# Altium schematic sheet Analog Interfaces.SchDoc: Analog Interfaces
size A4; Date: Not used; ApprovedBy: Not used; CheckedBy: Not used; Author: Not used; CompanyName: STMicroelectronics; DrawnBy: Not used; Engineer: Not used; Organization: Not used; Address1: Not used; Address2: Not used; Address3: Not used; Address4: Not used; DocumentNumber: Not used; Revision: Not used; SheetNumber: 13; SheetTotal: 22; CurrentTime: Not used; CurrentDate: Not used; Time: Not used; DocumentFullPathAndName: Not used; DocumentName: Not used; ModifiedDate: Not used; ImagePath: Not used; ProjectName: Not used; Application_BuildNumber: Not used
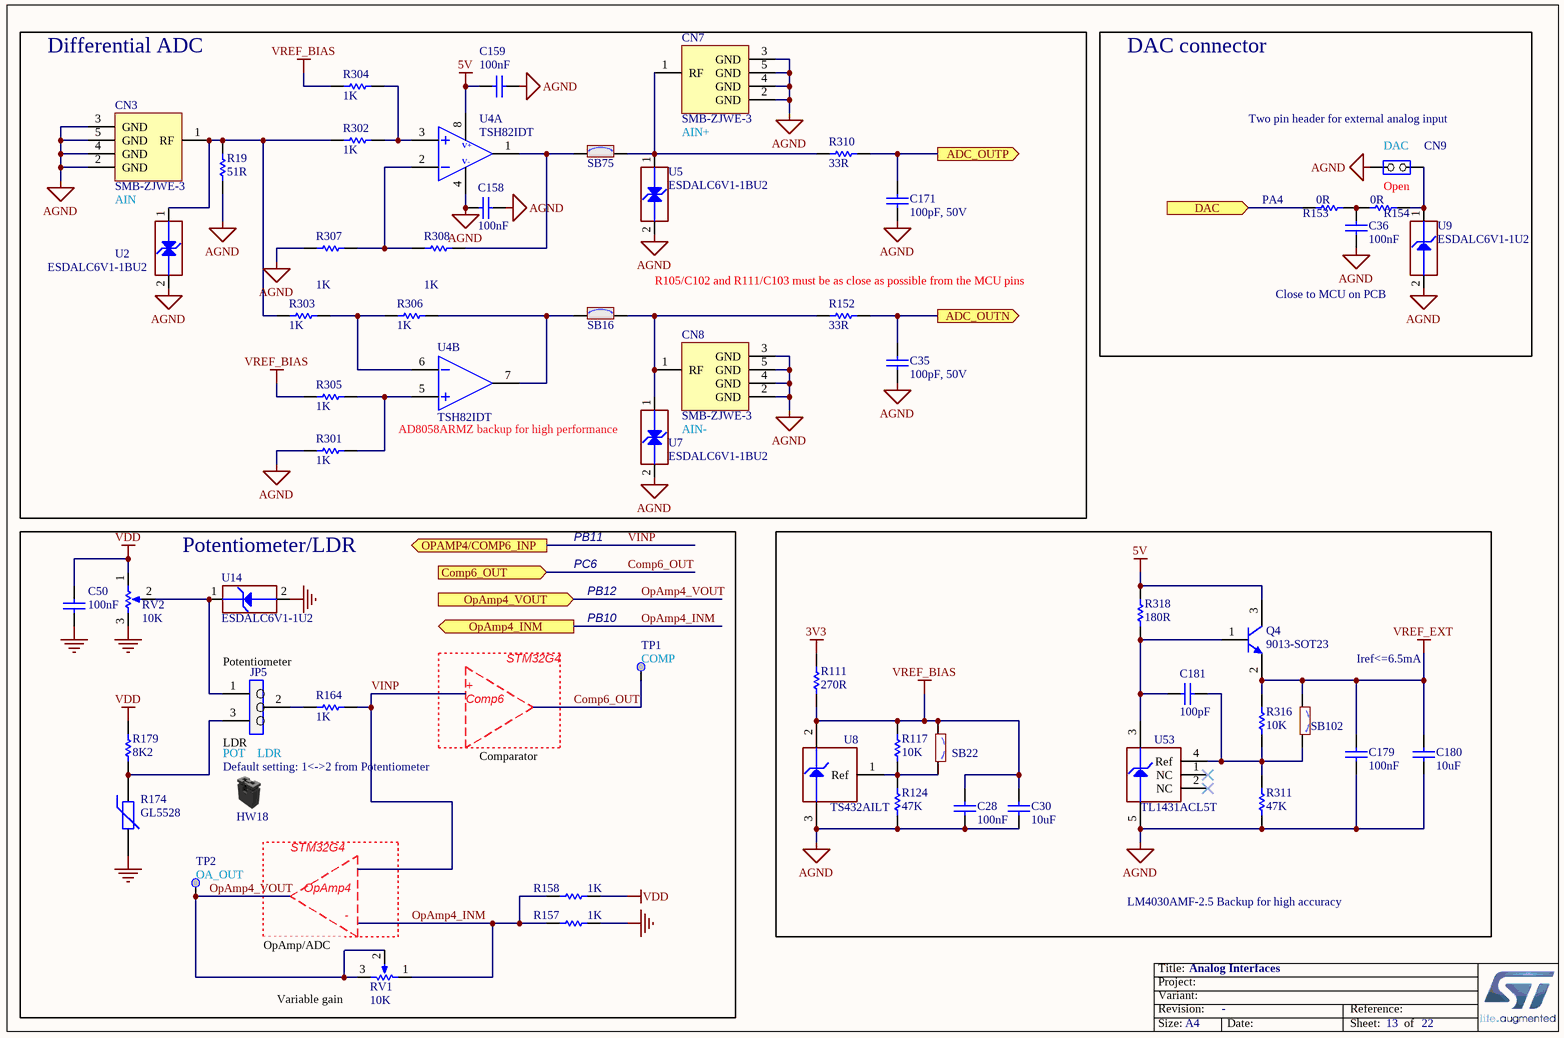
[diagram p0: Analog Interfaces.SchDoc]

## Parts
C28  value 100nF  [C0603]  (hidden comment: Capacitor)
C30  value 10uF  [C0603]  (hidden comment: Capacitor)
C35  value 100pF, 50V  [C0603]  (hidden comment: Capacitor)
C36  value 100nF  [C0603]  (hidden comment: Capacitor)
C50  value 100nF  [C0402]  (hidden comment: Capacitor)
C158  value 100nF  [C0603]  (hidden comment: Capacitor)
C159  value 100nF  [C0603]  (hidden comment: Capacitor)
C171  value 100pF, 50V  [C0603]  (hidden comment: Capacitor)
C179  value 100nF  [C0603]  (hidden comment: Capacitor)
C180  value 10uF  [C0603]  (hidden comment: Capacitor)
C181  value 100pF  [C0402]  (hidden comment: Capacitor)
CN3  SMB-ZJWE-3  [CON_JACK-RIGHT-ANGLE_YJ-ELECTRONIC_SMB-ZJWE-3]
CN7  SMB-ZJWE-3  [CON_JACK-RIGHT-ANGLE_YJ-ELECTRONIC_SMB-ZJWE-3]
CN8  SMB-ZJWE-3  [CON_JACK-RIGHT-ANGLE_YJ-ELECTRONIC_SMB-ZJWE-3]
CN9  Jumper_Header 2x1  [CON_SAMTEC_TSW-102-07-G-S]  (value not drawn)
HW18  Shunt Black 2.54mm  (value not drawn)  (mechanical)
JP5  Jumper_Header 3x1  [CON_SAMTEC_TSW-103-07-F-S]  (value not drawn)
Q4  9013-SOT23  [NPN_SOT23]
R19  value 51R  [R0603]  (hidden comment: Resistor)
R111  value 270R  [R0603]  (hidden comment: Resistor)
R117  value 10K  [R0603]  (hidden comment: Resistor)
R124  value 47K  [R0603]  (hidden comment: Resistor)
R152  value 33R  [R0603]  (hidden comment: Resistor)
R153  value 0R  [R0603]  (hidden comment: Resistor)
R154  value 0R  [R0603]  (hidden comment: Resistor)
R157  value 1K  [R0603]  (hidden comment: Resistor)
R158  value 1K  [R0603]  (hidden comment: Resistor)
R164  value 1K  [R0603]  (hidden comment: Resistor)
R174  value GL5528  [PHO_SENBAN_GL55XX]  (hidden comment: PT100)
R179  value 8K2  [R0603]  (hidden comment: Resistor)
R301  value 1K  [R0603]  (hidden comment: Resistor)
R302  value 1K  [R0603]  (hidden comment: Resistor)
R303  value 1K  [R0603]  (hidden comment: Resistor)
R304  value 1K  [R0603]  (hidden comment: Resistor)
R305  value 1K  [R0603]  (hidden comment: Resistor)
R306  value 1K  [R0603]  (hidden comment: Resistor)
R307  value 1K  [R0603]  (hidden comment: Resistor)
R308  value 1K  [R0603]  (hidden comment: Resistor)
R310  value 33R  [R0603]  (hidden comment: Resistor)
R311  value 47K  [R0603]  (hidden comment: Resistor)
R316  value 10K  [R0603]  (hidden comment: Resistor)
R318  value 180R  [R0603]  (hidden comment: Resistor)
RV1  value 10K  [POT_BOURNS_3314J-1]  (hidden comment: POTENTIOMETER)
RV2  value 10K  [POT_BOURNS_3386P]  (hidden comment: POTENTIOMETER)
SB16  SB_ON  [SOLDER-BRIDGE_R0603-0R]  (value not drawn)
SB22  SB_OFF  [SOLDER-BRIDGE_R0603-0R]  (value not drawn)
SB75  SB_ON  [SOLDER-BRIDGE_R0603-0R]  (value not drawn)
SB102  SB_OFF  [SOLDER-BRIDGE_R0603-0R]  (value not drawn)
TP1  Test Point  [TP_SMD_1MM]  (value not drawn)  (no BOM)
TP2  Test Point  [TP_SMD_1MM]  (value not drawn)  (no BOM)
U2  value ESDALC6V1-1BU2  [ESD_ST0201]  (hidden comment: ESD-TRANSIL-BIDIR)
U4  TSH82IDT  [ICC_SO8_5X4_P127]  (parts A,B of 2)
U5  value ESDALC6V1-1BU2  [ESD_ST0201]  (hidden comment: ESD-TRANSIL-BIDIR)
U7  value ESDALC6V1-1BU2  [ESD_ST0201]  (hidden comment: ESD-TRANSIL-BIDIR)
U8  TS432AILT  [ICC_SOT23-3L_H1P12]
U9  value ESDALC6V1-1U2  [ESD_ST0201]  (hidden comment: ESD-TRANSIL)
U14  value ESDALC6V1-1U2  [ESD_ST0201]  (hidden comment: ESD-TRANSIL)
U53  TL1431ACL5T  [ICC_SOT23-5L_H1P45]

## Blocks framed on the sheet
Differential ADC: C35 C158 C159 C171 CN3 CN7 CN8 R19 R152 R301-R308 R310 SB16 SB75 U2 U4 U5 U7
DAC connector: C36 CN9 R153 R154 U9
Potentiometer/LDR: C50 HW18 JP5 R157 R158 R164 R174 R179 RV1 RV2 TP1 TP2 U14

## Ports
ADC_OUTN (out), ADC_OUTP (out), Comp6_OUT (in), DAC (in), OPAMP4/COMP6_INP (out), OpAmp4_INM (out), OpAmp4_VOUT (in)

## Nets
3V3: R111.2
5V: C159.2 Q4.3(C) R318.2 U4.8
AGND: C28.1 C30.1 C35.2 C36.2 C158.1 C158.2 C159.1 C171.1 C179.1 C180.1 CN3.2(GND) CN3.3(GND) CN3.4(GND) CN3.5(GND) CN7.2(GND) CN7.3(GND) CN7.4(GND) CN7.5(GND) CN8.2(GND) CN8.3(GND) CN8.4(GND) CN8.5(GND) CN9.2(NO) R19.1 R124.1 R301.2 R307.2 R311.1 U2.2(GND) U4.4 U5.2(GND) U7.2(GND) U8.3(Anode) U9.2(GND) U53.5(Anode)
GND: C50.2 R157.2 R174.2 RV2.3(TOP) U14.2(GND)
VDD: C50.1 R158.2 R179.2 RV2.1(BOT)
VREF_BIAS: C28.2 C30.2 R111.1 R117.2 R304.1 R305.1 SB22.1 U8.2(Cathode)
VREF_EXT: C179.2 C180.2 Q4.2(E) R316.2 SB102.1
ADC_OUTN: C35.1 R152.2 ; port ADC_OUTN
ADC_OUTP: C171.2 R310.2 ; port ADC_OUTP
Comp6_OUT: TP1.1 ; port Comp6_OUT
DAC: R153.2 ; port DAC
OpAmp4_INM: R157.1 R158.1 RV1.1(BOT) ; port OpAmp4_INM
OpAmp4_VOUT: RV1.2(TAP) RV1.3(TOP) TP2.1 ; port OpAmp4_VOUT
VINP: R164.1 ; port OPAMP4/COMP6_INP
NetC36_1: C36.1 R153.1 R154.1
NetC181_1: C181.1 R311.2 R316.1 SB102.2 U53.4(Ref)
NetC181_2: C181.2 Q4.1(B) R318.1 U53.3(Cathode)
NetCN3_1: CN3.1(RF) R19.2 R302.1 R303.2 U2.1(IO1)
NetCN7_1: CN7.1(RF) R310.1 SB75.2 U5.1(IO1)
NetCN8_1: CN8.1(RF) R152.1 SB16.2 U7.1(IO1)
NetCN9_1: CN9.1(COMMON) R154.2 U9.1(IO1)
NetJP5_1: JP5.1 RV2.2(TAP) U14.1(IO1)
NetJP5_2: JP5.2 R164.2
NetJP5_3: JP5.3 R174.1 R179.1
NetR117_1: R117.1 R124.2 SB22.2 U8.1(Ref)
NetR301_1: R301.1 R305.2 U4.5
NetR302_2: R302.2 R304.2 U4.3
NetR303_1: R303.1 R306.2 U4.6
NetR306_1: R306.1 SB16.1 U4.7
NetR307_1: R307.1 R308.2 U4.2
NetR308_1: R308.1 SB75.1 U4.1

Not connected (* = marked no-connect by the designer): U53 1(NC)* 2(NC)*

## Notes on the sheet
- AIN+
- (near CN9) Two pin header for external analog input
- (near CN9) DAC
- AIN
- (near R153) PA4
- Open
- (near R152) R105/C102 and R111/C103 must be as close as possible from the MCU pins
- Close to MCU on PCB
- AD8058ARMZ backup for high performance
- AIN-
- PB11
- PC6
- PB12
- (near TP1) PB10
- Potentiometer
- +
- Comp6
- STM32G4
- (near TP1) COMP
- Iref<=6.5mA
- (near JP5) LDR
- (near HW18) Default setting: 1<->2 from Potentiometer
- (near HW18) POT    LDR
- Comparator
- (near TP2) OA_OUT
- OpAmp4
- (near RV1) -
- LM4030AMF-2.5 Backup for high accuracy
- (near RV1) OpAmp/ADC
- (near RV1) Variable gain
- Title:
- Project:
- Size:
- Revision:
- Variant:
- A4
- Date:
- Reference:
- Sheet:
- of
- (in symbol MCD-01205, part A) V+; V-

## Library data of the parts
C28 C36 C158 C159 C179 = MCD-00211: Capacitor, MLCC, 100nF, 16V, X7R, 10%, 0603, T=0,8mm; Manufacturer_Part_Number: CC0603KRX7R7BB104; Manufacturer: YAGEO; Provided_By: SUBCO; Initial_Board_Reference: MB1319; Path: ws/MCD_ApplicationBoards/Lists/MCDPARTSdatabase; Item Type: Item; Internal_Part_Number: MCD-00211; Status: Released; Part_Type: Capacitor; Package: C0603; ComponentLink1Description: Datasheet; ComponentLink1URL: http://tunmcdsvn.tun.st.com/Component_Datasheet_Library/Trunk/Capacitors/Yageo_Multilayer_Capacitor_X7R_series_100pF_to_22uF
C30 C180 = MCD-01124: Capacitor, MLCC, 10µF, 10V, X5R, 10%, 0603, T=0.8mm; Manufacturer_Part_Number: GRM188R61A106KAAL; Manufacturer: MURATA; Provided_By: SUBCO; Initial_Board_Reference: MB1361; Path: ws/MCD_ApplicationBoards/Lists/MCDPARTSdatabase; Item Type: Item; Internal_Part_Number: MCD-01124; Status: Released; Part_Type: Capacitor; Package: C0603; ComponentLink1Description: Datasheet; ComponentLink1URL: http://tunmcdsvn.tun.st.com/Component_Datasheet_Library/Trunk/Capacitors/Murata_Capacitor_GR_series
C35 C171 = MCD-01101: Capacitor,100pF,50V,X7R,10%,0603; Manufacturer_Part_Number: 06035C101JAT4A; Manufacturer: AVX; Provided_By: SUBCO; Initial_Board_Reference: MB1381; Path: ws/MCD_ApplicationBoards/Lists/MCDPARTSdatabase; Item Type: Item; Internal_Part_Number: MCD-01101; Status: Footprint available; Part_Type: Capacitor; Package: C0603; ComponentLink1Description: Datasheet; ComponentLink1URL: http://tunmcdsvn.tun.st.com/Component_Datasheet_Library/Trunk/Capacitors/AVX_Capacitor_X7R-series/AVX_X7R-series.pdf
C50 = MCD-00006: Capacitor, MLCC, 100nF, 16V, X7R, 10%, 0402, T=0.5mm; Manufacturer_Part_Number: CC0402KRX7R7BB104; Manufacturer: YAGEO; Alternate_Manufacturer_Part_Number: GCM155R71C104KA55D; Alternate_Manufacturer: MURATA; Provided_By: SUBCO; Initial_Board_Reference: MB1274; Path: ws/MCD_ApplicationBoards/Lists/MCDPARTSdatabase; Item Type: Item; Internal_Part_Number: MCD-00006; ComponentLink1Description: Datasheet; Status: Released; Package: C0402; Part_Type: Capacitor; ComponentLink1URL: http://tunmcdsvn.tun.st.com/Component_Datasheet_Library/Trunk/Capacitors/Yageo_Multilayer_Capacitor_X7R_series_100pF_to_22uF
C181 = MCD-00205: Capacitor, MLCC, 100pF, 50V, NPO, 5%, 0402, T=0,5mm; Manufacturer_Part_Number: CC0402JRNPO9BN101; Manufacturer: YAGEO; Provided_By: SUBCO; Initial_Board_Reference: MB1361; Path: ws/MCD_ApplicationBoards/Lists/MCDPARTSdatabase; Item Type: Item; Internal_Part_Number: MCD-00205; Status: Released; Part_Type: Capacitor; Package: C0402; ComponentLink1Description: Datasheet; ComponentLink1URL: http://tunmcdsvn.tun.st.com/Component_Datasheet_Library/Trunk/Capacitors/Yageo_Capacitor_NP0_16V-to-50V
CN3 CN7 CN8 = MCD-01181: SMB type right angle jack for PCB; Part_Type: Connector; Manufacturer: Yangzhou JingCheng Electronic Co., LTD; Provided_By: SUBCO; Initial_Board_Reference: MB1397; Remark: Please validate carefuly the pin number between schematic symbol and footprint as datasheet not mention it.; Path: ws/MCD_ApplicationBoards/Lists/MCDPARTSdatabase; Item Type: Item; Internal_Part_Number: MCD-01181; Value: SMB-ZJWE-3; Status: Checked; Manufacturer_Part_Number: SMB-ZJWE-3; ComponentLink1Description: Datasheet; ComponentLink1URL: http://tunmcdsvn.tun.st.com/Component_Datasheet_Library/Trunk/Connectors/JingCheng_SMB-ZJWE-3/
CN9 = MCD-00045: Header, 2x1, 2,54mm, VR, TH, Height 5.84mm/2.54mm; Manufacturer_Part_Number: TSW-102-07-x-S; Manufacturer: SAMTEC; Part_Type: Connector; Value: Shunt not fitted; Provided_By: SUBCO; Initial_Board_Reference: MB1274; Path: ws/MCD_ApplicationBoards/Lists/MCDPARTSdatabase; Item Type: Item; Internal_Part_Number: MCD-00045; ComponentLink1Description: Datasheet; Status: Released; ComponentLink1URL: http://tunmcdsvn.tun.st.com/Component_Datasheet_Library/Trunk/Connectors/Samtec_TSW-HTSW-series
HW18 = MCD-00043: SHUNT 2.54mm BLACK; Part_Type: Mechanical; Manufacturer_Part_Number: SNT-100-BK-G; Manufacturer: SAMTEC; Provided_By: SUBCO; Initial_Board_Reference: MB1274; Value: SNT-100-BK-G; Path: ws/MCD_ApplicationBoards/Lists/MCDPARTSdatabase; Item Type: Item; Internal_Part_Number: MCD-00043; Status: Released; ComponentLink1Description: Datasheet; ComponentLink1URL: http://tunmcdsvn.tun.st.com/Component_Datasheet_Library/Trunk/Connectors/Samtec_Shunt_Jumper_SNT100
JP5 = MCD-00111: Header, 3x1, 2,54mm, VR, TH, Height 5.84mm/2.54mm; Part_Type: Connector; Manufacturer_Part_Number: TSW-103-07-F-S; Manufacturer: SAMTEC; Provided_By: SUBCO; Initial_Board_Reference: MB1262; Path: ws/MCD_ApplicationBoards/Lists/MCDPARTSdatabase; Item Type: Item; Internal_Part_Number: MCD-00111; Value: Header 3x1; Status: Released; ComponentLink1Description: Datasheet; ComponentLink1URL: http://tunmcdsvn.tun.st.com/Component_Datasheet_Library/Trunk/Connectors/Samtec_TSW-HTSW-series
Q4 = MCD-00073: NPN Bipolar Transistor; Part_Type: IC; Manufacturer_Part_Number: BSR14; Manufacturer: NXP; Provided_By: SUBCO; Initial_Board_Reference: MB1274; Path: ws/MCD_ApplicationBoards/Lists/MCDPARTSdatabase; Item Type: Item; Revision: *; Internal_Part_Number: MCD-00073; Value: 9013-SOT23; Status: Released; ComponentLink1Description: Datasheet; ComponentLink1URL: http://tunmcdsvn.tun.st.com/Component_Datasheet_Library/Trunk/IC/NXP_Transistor_BSR14
R19 = MCD-00486: Resistor,51R,0603,1%,1/10W; Manufacturer_Part_Number: RC0603FR-0751RL; Manufacturer: YAGEO; Provided_By: SUBCO; Initial_Board_Reference: MBxxxx; Path: ws/MCD_ApplicationBoards/Lists/MCDPARTSdatabase; Item Type: Item; Internal_Part_Number: MCD-00486; Status: Released; Part_Type: Resistor; Package: R0603; ComponentLink1Description: Datasheet; ComponentLink1URL: http://tunmcdsvn.tun.st.com/Component_Datasheet_Library/Trunk/Resistors/Yageo_Resistor_RC0603-series
R111 = MCD-00442: Resistor,270R,0603,1%,1/10W; Manufacturer_Part_Number: RC0603FR-07270RL; Manufacturer: YAGEO; Provided_By: SUBCO; Initial_Board_Reference: MBxxxx; Path: ws/MCD_ApplicationBoards/Lists/MCDPARTSdatabase; Item Type: Item; Internal_Part_Number: MCD-00442; Status: Released; Part_Type: Resistor; Package: R0603; ComponentLink1Description: Datasheet; ComponentLink1URL: http://tunmcdsvn.tun.st.com/Component_Datasheet_Library/Trunk/Resistors/Yageo_Resistor_RC0603-series
R117 R316 = MCD-00220: Resistor,10K,0603,1%,1/10W; Manufacturer_Part_Number: RC0603FR-0710KL; Manufacturer: YAGEO; Provided_By: SUBCO; Initial_Board_Reference: MB1319; Path: ws/MCD_ApplicationBoards/Lists/MCDPARTSdatabase; Item Type: Item; Internal_Part_Number: MCD-00220; Status: Released; Part_Type: Resistor; Package: R0603; ComponentLink1Description: Datasheet; ComponentLink1URL: http://tunmcdsvn.tun.st.com/Component_Datasheet_Library/Trunk/Resistors/Yageo_Resistor_RC0603-series
R124 R311 = MCD-00222: Resistor,47K,0603,1%,1/10W; Manufacturer_Part_Number: RC0603FR-0747KL; Manufacturer: YAGEO; Provided_By: SUBCO; Initial_Board_Reference: MB1319; Path: ws/MCD_ApplicationBoards/Lists/MCDPARTSdatabase; Item Type: Item; Internal_Part_Number: MCD-00222; Status: Released; Part_Type: Resistor; Package: R0603; ComponentLink1Description: Datasheet; ComponentLink1URL: http://tunmcdsvn.tun.st.com/Component_Datasheet_Library/Trunk/Resistors/Yageo_Resistor_RC0603-series
R152 R310 = MCD-00456: Resistor,33R,0603,1%,1/10W; Manufacturer_Part_Number: RC0603FR-0733RL; Manufacturer: YAGEO; BMS_Part_Number: 9129732; Provided_By: SUBCO; Initial_Board_Reference: MBxxxx; Path: ws/MCD_ApplicationBoards/Lists/MCDPARTSdatabase; Item Type: Item; Internal_Part_Number: MCD-00456; Status: Released; Part_Type: Resistor; Package: R0603; ComponentLink1Description: Datasheet; ComponentLink1URL: http://tunmcdsvn.tun.st.com/Component_Datasheet_Library/Trunk/Resistors/Yageo_Resistor_RC0603-series
R153 R154 = MCD-00056: Resistor,0R,0603,5%,1/10W; Manufacturer_Part_Number: RC0603JR-070RL; Manufacturer: YAGEO; Provided_By: SUBCO; Initial_Board_Reference: MB1274; Path: ws/MCD_ApplicationBoards/Lists/MCDPARTSdatabase; Item Type: Item; Internal_Part_Number: MCD-00056; ComponentLink1Description: Datasheet; Status: Released; Part_Type: Resistor; Package: R0603; ComponentLink1URL: http://tunmcdsvn.tun.st.com/Component_Datasheet_Library/Trunk/Resistors/Yageo_Resistor_RC0603-series
R157 R158 R164 R301-R308 = MCD-00070: Resistor,1K,0603,1%,1/10W; Manufacturer_Part_Number: RC0603FR-071KL; Manufacturer: YAGEO; Provided_By: SUBCO; Initial_Board_Reference: MB1274; Path: ws/MCD_ApplicationBoards/Lists/MCDPARTSdatabase; Item Type: Item; Internal_Part_Number: MCD-00070; Status: Released; Part_Type: Resistor; Package: R0603; ComponentLink1Description: Datasheet; ComponentLink1URL: http://tunmcdsvn.tun.st.com/Component_Datasheet_Library/Trunk/Resistors/Yageo_Resistor_RC0603-series
R174 = MCD-01158: GL55 series  photoconductive cell: Light resistance 10Lux range 10-20KOhm, Dark 1MOhm; Part_Type: Misc; Manufacturer: SHENZHEN SENBAN OPTICAL & ELECTRONIC CO. LTD; Provided_By: SUBCO; Initial_Board_Reference: MB1397; Path: ws/MCD_ApplicationBoards/Lists/MCDPARTSdatabase; Item Type: Item; Internal_Part_Number: MCD-01158; Status: Released; Manufacturer_Part_Number: GL5528; ComponentLink1Description: Datasheet; ComponentLink1URL: http://tunmcdsvn.tun.st.com/Component_Datasheet_Library/Trunk/Misc/SENBAN_photoconductive_GL55xx/
R179 = MCD-00530: Resistor,8K2,0603,1%,1/10W; Manufacturer_Part_Number: RC0603FR-078K2L; Manufacturer: YAGEO; Provided_By: SUBCO; Initial_Board_Reference: MBxxxx; Path: ws/MCD_ApplicationBoards/Lists/MCDPARTSdatabase; Item Type: Item; Internal_Part_Number: MCD-00530; Status: Released; Part_Type: Resistor; Package: R0603; ComponentLink1Description: Datasheet; ComponentLink1URL: http://tunmcdsvn.tun.st.com/Component_Datasheet_Library/Trunk/Resistors/Yageo_Resistor_RC0603-series
R318 = MCD-00342: Resistor,180R,0603,1%,1/10W; Manufacturer_Part_Number: RC0603FR-07180RL; Manufacturer: YAGEO; Provided_By: SUBCO; Initial_Board_Reference: MBxxxx; Path: ws/MCD_ApplicationBoards/Lists/MCDPARTSdatabase; Item Type: Item; Internal_Part_Number: MCD-00342; Status: Released; Part_Type: Resistor; Package: R0603; ComponentLink1Description: Datasheet; ComponentLink1URL: http://tunmcdsvn.tun.st.com/Component_Datasheet_Library/Trunk/Resistors/Yageo_Resistor_RC0603-series
RV1 = MCD-01169: 4mm Square Trimming Potentiometer 10K OHM 0.25W PC PIN; Part_Type: Resistor; Manufacturer_Part_Number: 3314J-1-103; Manufacturer: BOURNS; Provided_By: SUBCO; Initial_Board_Reference: MB1397; Path: ws/MCD_ApplicationBoards/Lists/MCDPARTSdatabase; Item Type: Item; Internal_Part_Number: MCD-01169; Status: Released; ComponentLink1Description: Datasheet; ComponentLink1URL: http://tunmcdsvn.tun.st.com/Component_Datasheet_Library/Trunk/Resistors/Bourns_Potentiometer_3314_series
RV2 = MCD-00575: TRIMMER 10K OHM 0.5W PC PIN; Part_Type: Resistor; Manufacturer_Part_Number: 3386P-1-103; Manufacturer: BOURNS; Provided_By: SUBCO; Initial_Board_Reference: MB1331; Path: ws/MCD_ApplicationBoards/Lists/MCDPARTSdatabase; Item Type: Item; Internal_Part_Number: MCD-00575; Status: Released; ComponentLink1Description: Datasheet; ComponentLink1URL: http://tunmcdsvn.tun.st.com/Component_Datasheet_Library/Trunk/Resistors/Bourns_Potentiometer_3386_series
SB16 SB75 = MCD-00071: Solder Bridge ON; Part_Type: Mechanical; Manufacturer_Part_Number: RC0603JR-070RL; Manufacturer: YAGEO; Provided_By: SUBCO; Initial_Board_Reference: MB1274; Path: ws/MCD_ApplicationBoards/Lists/MCDPARTSdatabase; Item Type: Item; Internal_Part_Number: MCD-00071; Status: Released; ComponentLink1Description: Datasheet; Package: SB0603; ComponentLink1URL: http://tunmcdsvn.tun.st.com/Component_Datasheet_Library/Trunk/Resistors/Yageo_Resistor_RC0603-series
SB22 SB102 = MCD-00072: Solder Bridge OFF; Part_Type: Mechanical; Manufacturer_Part_Number: RC0603JR-070RL; Manufacturer: YAGEO; Provided_By: SUBCO; Initial_Board_Reference: MB1274; Path: ws/MCD_ApplicationBoards/Lists/MCDPARTSdatabase; Item Type: Item; Internal_Part_Number: MCD-00072; Status: Released; ComponentLink1Description: Datasheet; Package: SB0603; ComponentLink1URL: http://tunmcdsvn.tun.st.com/Component_Datasheet_Library/Trunk/Resistors/Yageo_Resistor_RC0603-series
TP1 TP2 = MCD-00074: Test Point 1mm; Part_Type: Mechanical; Initial_Board_Reference: MB1274; Path: ws/MCD_ApplicationBoards/Lists/MCDPARTSdatabase; Item Type: Item; Internal_Part_Number: MCD-00074; Provided_By: n/a; Status: Released; ComponentLink1Description: Datasheet; ComponentLink1URL: http://na; Manufacturer: n/a; Manufacturer_Part_Number: n/a
U2 U5 U7 = MCD-01242: Single-line low capacitance Transil for bidirectional ESD protection 6V1; Part_Type: Diode; Manufacturer: STMICROELECTRONICS; Provided_By: SUBCO with ST control; Initial_Board_Reference: MB1397; Path: ws/MCD_ApplicationBoards/Lists/MCDPARTSdatabase; Item Type: Item; Internal_Part_Number: MCD-01242; Status: Checked; Manufacturer_Part_Number: ESDALC6V1-1BU2; ComponentLink1Description: Datasheet; ComponentLink1URL: http://tunmcdsvn.tun.st.com/Component_Datasheet_Library/Trunk/Diodes/STM_ESD_ESDALC6V1-1BU2; Package: ST0201
U4 = MCD-01205: Wide-band Rail-to-Rail operational amplifiers with standby function; Part_Type: IC; Manufacturer: STMICROELECTRONICS; Provided_By: SUBCO with ST control; Initial_Board_Reference: MB1397; Path: ws/MCD_ApplicationBoards/Lists/MCDPARTSdatabase; Item Type: Item; Internal_Part_Number: MCD-01205; Value: TSH82IDT; Status: Checked; Manufacturer_Part_Number: TSH82IDT; Package: SO8; ComponentLink1Description: Datasheet; ComponentLink1URL: http://tunmcdsvn.tun.st.com/Component_Datasheet_Library/Trunk/IC/STM_Amp-Ops_TSH82IDT
U8 = MCD-01204: 1.24V adjustable shunt voltage reference, Precision 0.5%; Part_Type: IC; Manufacturer: STMICROELECTRONICS; Provided_By: SUBCO with ST control; Initial_Board_Reference: MB1397; Remark: PCH: schematics symbol update please to check.Eric: pin 1 and 2 isn't same for schematic and footprint. please find update SchLib on Template.; Path: ws/MCD_ApplicationBoards/Lists/MCDPARTSdatabase; Item Type: Item; Internal_Part_Number: MCD-01204; Value: TS432AILT; Status: Checked; Manufacturer_Part_Number: TS432AILT; Package: SOT23-3L; ComponentLink1Description: Datasheet; ComponentLink1URL: http://tunmcdsvn.tun.st.com/Component_Datasheet_Library/Trunk/IC/STM_voltage_reference_TS432AILT
U9 U14 = MCD-00170: ESD protection 6V1; Part_Type: Diode; Manufacturer: STMICROELECTRONICS; BMS_Part_Number: 9151132; Provided_By: SUBCO with ST control; Initial_Board_Reference: MB1274; Path: ws/MCD_ApplicationBoards/Lists/MCDPARTSdatabase; Item Type: Item; Internal_Part_Number: MCD-00170; Status: Released; Manufacturer_Part_Number: ESDALC6V1-1U2; ComponentLink1Description: Datasheet; ComponentLink1URL: http://tunmcdsvn.tun.st.com/Component_Datasheet_Library/Trunk/Diodes/STM_ESD_ESDALC6V1-1U2
U53 = MCD-01157: Programmable voltage reference; Part_Type: IC; Manufacturer: STMICROELECTRONICS; Provided_By: SUBCO with ST control; Initial_Board_Reference: MB1397; Path: ws/MCD_ApplicationBoards/Lists/MCDPARTSdatabase; Item Type: Item; Internal_Part_Number: MCD-01157; Value: TL1431ACL5T; Status: Checked; Manufacturer_Part_Number: TL1431ACL5T; Package: SOT23-5L; ComponentLink1Description: Datasheet; ComponentLink1URL: http://tunmcdsvn.tun.st.com/Component_Datasheet_Library/Trunk/IC/STM_voltage_reference_TL1431ACL5T/